# EAGLE design futurew (EAGLE 9.4.1)
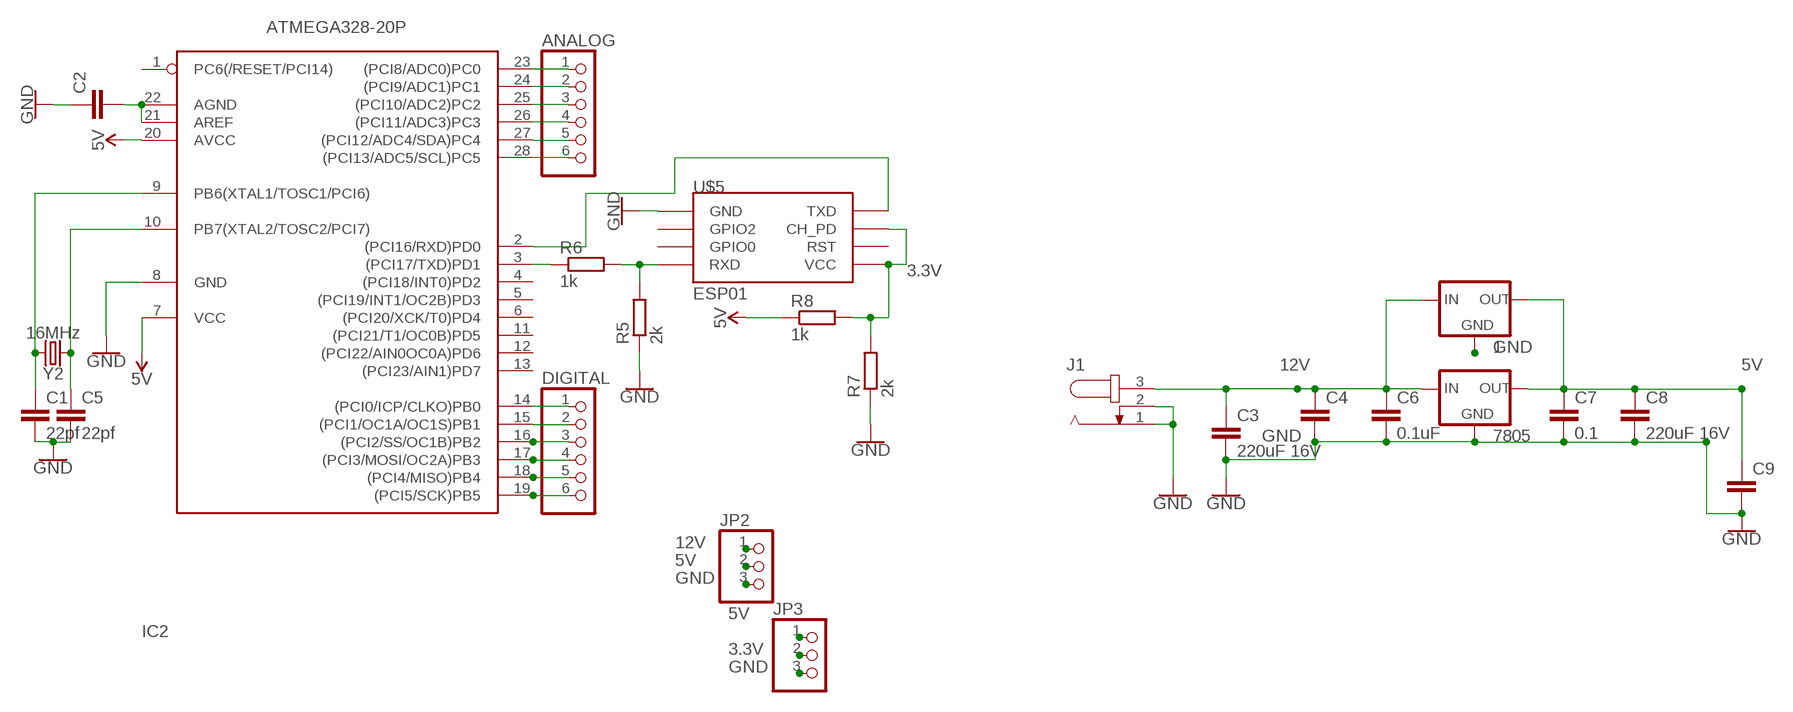
[diagram p0: schematic, sheet 1]

## Parts
1  78XXL  [78XXL]
7805  78XXL  [78XXL]
ANALOG  PINHD-1X6  [1X06]
C1  22pf  C2,5-3  [C2.5-3]
C2  C2,5-3  [C2.5-3]
C3  220uF 16V  C2,5-3  [C2.5-3]
C4  C2,5-3  [C2.5-3]
C5  22pf  C2,5-3  [C2.5-3]
C6  0.1uF  C2,5-3  [C2.5-3]
C7  0.1  C2,5-3  [C2.5-3]
C8  220uF 16V  C2,5-3  [C2.5-3]
C9  C2,5-3  [C2.5-3]
DIGITAL  PINHD-1X6  [1X06]
IC2  ATMEGA328-20P  [DIL28-3]
J1  JACK-PLUG1  [SPC4078]
JP2  PINHD-1X3  [1X03]
JP3  PINHD-1X3  [1X03]
R5  2k  R-EU_0204/5  [0204/5]
R6  1k  R-EU_0204/5  [0204/5]
R7  2k  R-EU_0204/5  [0204/5]
R8  1k  R-EU_0204/5  [0204/5]
U$5  ESP01  [ESP01]
Y2  16MHz  CRYSTAL-16MHZPTH-HC49US  [HC49US]

## Nets
3.3V: JP3.2 R7.2 R8.2 U$5.CH_PD U$5.VCC
5V: 1.OUT 7805.OUT C7.1 C8.1 C9.1 IC2.7(VCC) IC2.20(AVCC) JP2.2 JP3.1 R8.1
12V: 1.IN 7805.IN C3.1 C4.1 C6.1 J1.3 JP2.1
GND: 1.GND 7805.GND C1.2 C2.1 C3.2 C4.2 C5.2 C6.2 C7.2 C8.2 C9.2 IC2.8(GND) J1.1 J1.2 JP2.3 JP3.3 R5.1 R7.1 U$5.GND
N$1: R5.2 R6.2 U$5.RX(RXD)
N$2: IC2.3((PCI17/TXD)PD1) R6.1
N$3: IC2.2((PCI16/RXD)PD0) U$5.TX(TXD)
N$4: DIGITAL.6 IC2.19((PCI5/SCK)PB5)
N$5: DIGITAL.5 IC2.18((PCI4/MISO)PB4)
N$6: DIGITAL.4 IC2.17((PCI3/MOSI/OC2A)PB3)
N$7: DIGITAL.3 IC2.16((PCI2/SS/OC1B)PB2)
N$8: ANALOG.1 IC2.23((PCI8/ADC0)PC0)
N$9: ANALOG.2 IC2.24((PCI9/ADC1)PC1)
N$10: ANALOG.3 IC2.25((PCI10/ADC2)PC2)
N$11: C2.2 IC2.21(AREF) IC2.22(AGND)
N$12: ANALOG.4 IC2.26((PCI11/ADC3)PC3)
N$13: ANALOG.5 IC2.27((PCI12/ADC4/SDA)PC4)
N$14: ANALOG.6 IC2.28((PCI13/ADC5/SCL)PC5)
N$15: DIGITAL.1 IC2.14((PCI0/ICP/CLKO)PB0)
N$16: DIGITAL.2 IC2.15((PCI1/OC1A/OC1S)PB1)
N$43: C5.1 IC2.10(PB7(XTAL2/TOSC2/PCI7)) Y2.1
N$45: C1.1 IC2.9(PB6(XTAL1/TOSC1/PCI6)) Y2.2
Unconnected: IC2.1(PC6(/RESET/PCI14)) IC2.4((PCI18/INT0)PD2) IC2.5((PCI19/INT1/OC2B)PD3) IC2.6((PCI20/XCK/T0)PD4) IC2.11((PCI21/T1/OC0B)PD5) IC2.12((PCI22/AIN0OC0A)PD6) IC2.13((PCI23/AIN1)PD7) U$5.GPIO0 U$5.GPIO2 U$5.RST

## Library data of the parts
1 7805 = v-reg:78XXL: VOLTAGE REGULATOR
ANALOG DIGITAL = pinhead:PINHD-1X6: PIN HEADER
C1-C9 = capacitor-wima:C: CAPACITOR naming: grid - package width
IC2 = atmega328:ATMEGA328*P: MICROCONTROLLER 32 kBytes FLASH 2 kBytes SRAM 1 kBytes EEPROM USART 8-channel 10 bit ADC
J1 = con-jack:JACK-PLUG: DC POWER JACK Power Jack, DC, Right Angle, Through Hole, Rated 5A at 16VDC, PC Terminals Distributor: Farnell (www.Farnell.de) Drawing: 84N1161.pdf / 84N1162.pdf Manufacturer: SPC Technology (www.spctechnology.com) Type: SPC4077 / SPC 4078; OC_FARNELL: unknown; OC_NEWARK: unknown
JP2 JP3 = pinhead:PINHD-1X3: PIN HEADER
R5-R8 = resistor:R-EU_: RESISTOR, European symbol
U$5 = esp8266modules:ESP01: ESP8266 Wifi module 01
Y2 = SparkFun-Clocks:CRYSTAL-16MHZ: 16MHz Crystal Digikey Example <http://www.digikey.com/product-search/en?keywords=535-9122-1-ND> Frequency: 16MHz Frequency Stability: ±50ppm Frequency Tolerance: ±20ppm Load Capacitance: 18pF SparkFun Products: Pro Micro -5V/16MHz <https://www.sparkfun.com/products/12640> SparkFun Serial Enabled LCD Kit <https://www.sparkfun.com/products/10097>; PROD_ID: XTAL-08181; SF_ID: COM-00536

## Net classes
0 default: width 1.016 mm, clearance 0.635 mm

## Board
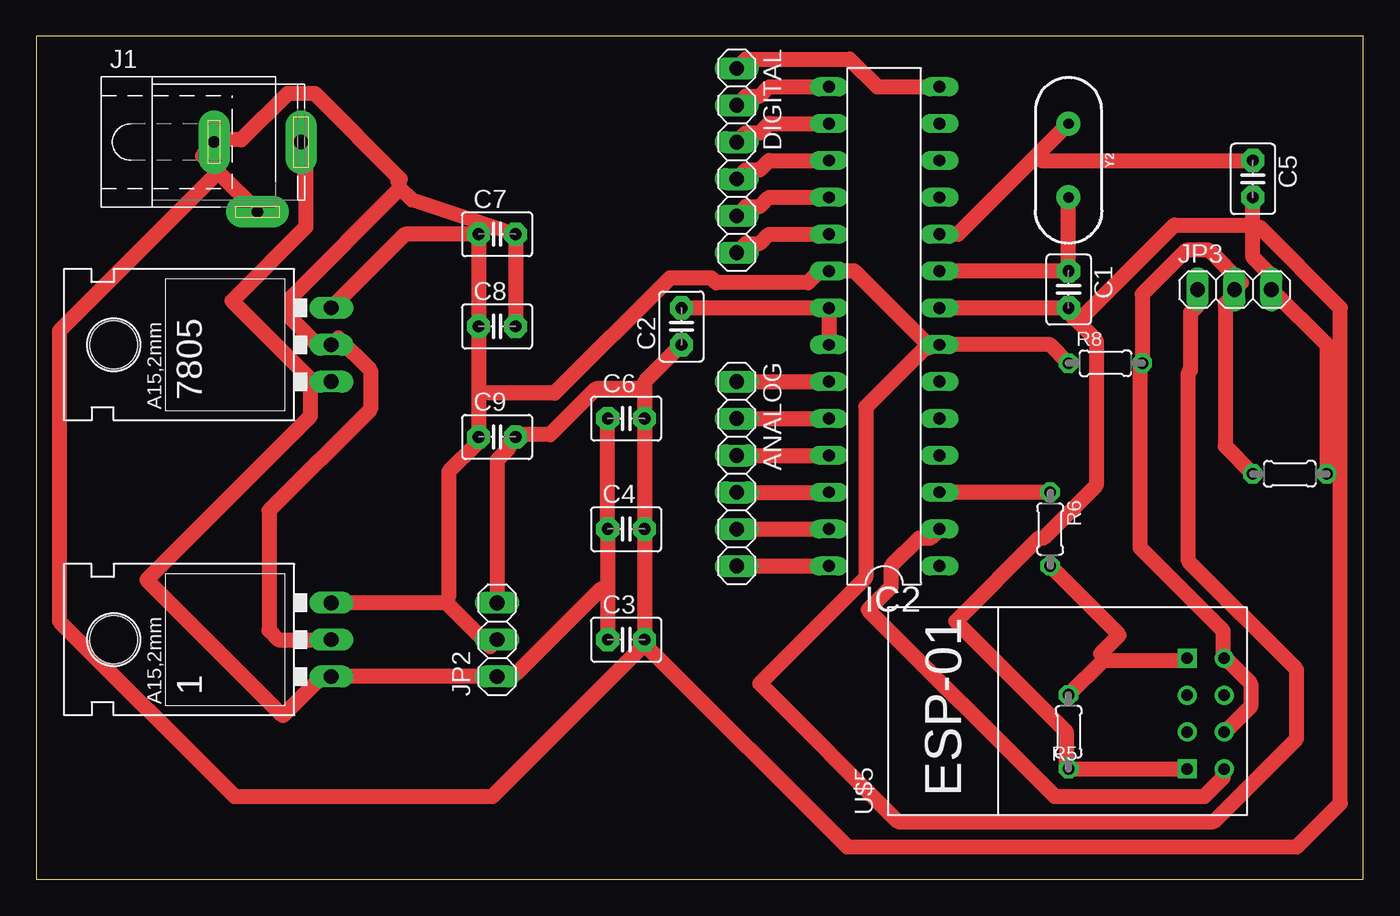
[diagram p1: board, top side]

Size 91.42 x 58.09 mm. Coordinates in mm from the lower left corner, seen from the top.
Outline: 0,0 91.42,0 91.42,58.09 0,58.09 0,0
Copper layers (1*16): Top 0.035mm / dielectric 1.5mm / Bottom 0.035mm
Design rules "default": minimum track width 6mil, minimum drill 0.35mm, track to track 6mil, track to pad 6mil, pad to pad 6mil, via to via 6mil, smd to smd 6mil, copper to edge 40mil, drill to drill 6mil, minimum pad ring 10mil, minimum via ring 8mil, stop-mask expansion 4mil, vias tented up to drill 0mil, thermal gap 10mil

### Footprints (pad centres in the part's own frame; a part is rotated, then mirrored left to right if it is on the bottom)
78XXL = drill 1.016 long: GND 0,-3.81; IN -2.54,-3.81; OUT 2.54,-3.81 | hole 3.302: 0,11.176
1X06 = drill 1.016 long: 1 -6.35,0; 2 -3.81,0; 3 -1.27,0; 4 1.27,0; 5 3.81,0; 6 6.35,0
C2.5-3 = drill 0.813 pad 1.6 octagon: 1 -1.27,0; 2 1.27,0
DIL28-3 = drill 0.813 long: 1 -16.51,-3.81; 2 -13.97,-3.81; 3 -11.43,-3.81; 4 -8.89,-3.81; 5 -6.35,-3.81; 6 -3.81,-3.81; 7 -1.27,-3.81; 8 1.27,-3.81; 9 3.81,-3.81; 10 6.35,-3.81; 11 8.89,-3.81; 12 11.43,-3.81; 13 13.97,-3.81; 14 16.51,-3.81; 15 16.51,3.81; 16 13.97,3.81; 17 11.43,3.81; 18 8.89,3.81; 19 6.35,3.81; 20 3.81,3.81; 21 1.27,3.81; 22 -1.27,3.81; 23 -3.81,3.81; 24 -6.35,3.81; 25 -8.89,3.81; 26 -11.43,3.81; 27 -13.97,3.81; 28 -16.51,3.81
SPC4078 = drill 0.8 pad 2.184 long: 1 -3,0; 2 0,-4.8 | drill 1 pad 2.184 long: 3 3,0
1X03 = drill 1.016 long: 1 -2.54,0; 2 0,0; 3 2.54,0
0204/5 = drill 0.813 octagon: 1 -2.54,0; 2 2.54,0
ESP01 = drill 0.8: CH_PD -1.285,-8.178; GPIO0 1.255,-5.638; GPIO2 -1.285,-5.638; RST 1.255,-8.178; TX -3.825,-8.178; VCC 3.795,-8.178 | drill 0.8 square: GND -3.825,-5.638; RX 3.795,-5.638
HC49US = drill 0.7 pad 1.651: 1 -2.54,0; 2 2.54,0

### Placement (x,y rotation side)
1  16.51,16.51 90 top
7805  16.51,36.83 90 top
ANALOG  48.26,27.94 270 top
C1  [C2.5-3]  71.12,40.64 270 top
C2  44.45,38.1 90 top
C3  40.64,16.51 0 top
C4  40.64,24.13 0 top
C5  [C2.5-3]  83.82,48.26 270 top
C6  40.64,31.75 0 top
C7  31.75,44.45 0 top
C8  31.75,38.1 0 top
C9  31.75,30.48 0 top
DIGITAL  48.26,49.53 270 top
IC2  58.42,38.1 90 top
J1  15.24,50.8 0 top
JP2  31.75,16.51 90 top
JP3  82.55,40.64 0 top
R5  [0204/5]  71.12,10.16 90 top
R6  [0204/5]  69.85,24.13 270 top
R7  [0204/5]  86.36,27.94 180 top
R8  [0204/5]  73.66,35.56 0 top
U$5  73.66,11.43 90 top
Y2  71.12,49.53 270 top

### Tracks (layer width: path | path; a pad name or v marks a point on that pad's centre or on a via)
3.3V
  Top 1.016: U$5.CH_PD 81.92,10.16 83.66,11.91 83.66,13.49 81.92,15.24 U$5.VCC 81.76,15.72 81.76,17.14 76.04,22.86 76.04,35.08 R8.2 76.2,40.32 79.22,43.34 80.8,43.34 83.03,41.12 JP3.2 82.39,40.16 81.92,39.69 81.92,29.84 R7.2
5V
  Top 1.016: 28.26,19.05 1.OUT | 28.26,19.05 31.27,16.03 JP2.2 | 30.48,33.5 C8.1 C7.1 25.4,44.45 7805.OUT | 30.48,33.5 C9.1 30.32,30 28.42,28.1 28.42,19.53 28.26,19.05 | IC2.7 69.85,36.83 R8.1 | IC2.7 61.75,36.83 61.59,36.67 56.36,41.91 IC2.20 54.13,42.07 53.18,41.12 46.83,41.12 46.51,41.43 43.66,41.43 35.72,33.5 30.48,33.5 | JP3.1 80.01,39.53 79.53,39.05 79.53,35.08 79.38,34.92 79.38,21.91 86.84,14.45 86.84,9.68 81.12,3.97 59.37,3.97 49.85,13.49 57.15,20.8 57.15,32.54 61.12,36.51 IC2.7
12V
  Top 1.016: 19.05,34.29 7805.IN | 19.05,34.29 13.49,39.85 18.57,44.93 18.57,50.48 18.26,50.8 J1.3 | 39.37,20 C4.1 C6.1 | 39.37,20 C3.1 | 39.37,20 38.89,20 33.02,14.13 32.23,14.13 JP2.1 1.IN 19.84,14.13 16.99,11.27 7.62,20.64 18.89,31.91 18.89,33.81 19.05,34.29
GND
  Top 1.016: R7.1 88.9,36.83 JP3.3 84.93,41.12 85.25,41.43 83.82,42.86 83.82,44.93 | 83.82,44.93 83.82,45.08 | 83.82,45.08 C5.2 | U$5.GND 79.22,7.62 R5.1 70.96,8.1 70.96,10.16 63.34,17.78 69.06,23.5 69.37,23.5 73.03,27.15 73.03,37.15 71.76,38.42 | IC2.8 C1.2 71.28,38.89 71.76,38.42 | 83.82,45.08 78.42,45.08 71.76,38.42 | JP2.3 31.75,28.89 32.54,29.69 32.54,30 C9.2 33.5,30.64 35.4,30.64 38.58,33.81 41.91,33.81 | C3.2 C4.2 C6.2 41.91,33.81 | 41.91,33.81 41.91,34.29 C2.1 | 12.54,48.74 11.43,49.85 12.38,50.8 J1.1 12.86,50.96 14.13,50.96 17.3,54.13 19.21,54.13 25.08,48.26 24.92,48.1 25.08,47.62 | 12.54,48.74 15.24,46.04 J1.2 | C8.2 C7.2 25.88,46.83 25.08,47.62 | 1.GND 16.67,16.51 16.03,17.14 16.03,25.4 23.02,32.38 23.02,35.08 20.8,37.31 7805.GND 19.84,36.99 19.53,36.67 17.62,38.58 17.62,40.16 25.08,47.62 | 12.54,48.74 1.59,37.78 1.59,17.78 13.65,5.71 31.43,5.71 41.75,16.03 C3.2 | 83.82,44.93 84.3,44.93 89.85,39.37 89.85,5.24 86.84,2.22 55.88,2.22 42.23,15.88 C3.2
N$1
  Top 1.016: 73.5,15.08 79.22,15.08 U$5.RX | R5.2 73.5,15.08 | R6.2 74.61,16.83 73.34,15.56 73.5,15.08
N$2
  Top 1.016: R6.1 IC2.3
N$3
  Top 1.016: IC2.2 61.59,23.5 60.8,23.5 58.9,21.59 58.9,20.16 57.31,18.57 70.17,5.71 80.49,5.71 81.76,6.99 81.76,7.46 U$5.TX
N$4
  Top 1.016: IC2.19 50.48,44.45 49.85,43.81 48.9,43.81 DIGITAL.6
N$5
  Top 1.016: IC2.18 50.48,46.99 49.85,46.35 48.9,46.35 DIGITAL.5
N$6
  Top 1.016: IC2.17 50.48,49.53 49.85,48.89 48.9,48.89 DIGITAL.4
N$7
  Top 1.016: IC2.16 50.48,52.07 49.85,51.43 48.9,51.43 DIGITAL.3
N$8
  Top 1.016: ANALOG.1 IC2.23
N$9
  Top 1.016: ANALOG.2 IC2.24
N$10
  Top 1.016: ANALOG.3 IC2.25
N$11
  Top 1.016: IC2.22 IC2.21 C2.2
N$12
  Top 1.016: ANALOG.4 IC2.26
N$13
  Top 1.016: ANALOG.5 IC2.27
N$14
  Top 1.016: ANALOG.6 IC2.28
N$15
  Top 1.016: IC2.14 57.94,54.61 56.04,56.51 48.9,56.51 DIGITAL.1
N$16
  Top 1.016: IC2.15 50.48,54.61 49.85,53.97 48.9,53.97 DIGITAL.2
N$43
  Top 1.016: IC2.10 63.5,44.45 68.9,49.85 | Y2.1 68.9,49.85 | C5.1 69.22,49.53 68.9,49.85
N$45
  Top 1.016: IC2.9 C1.1 Y2.2